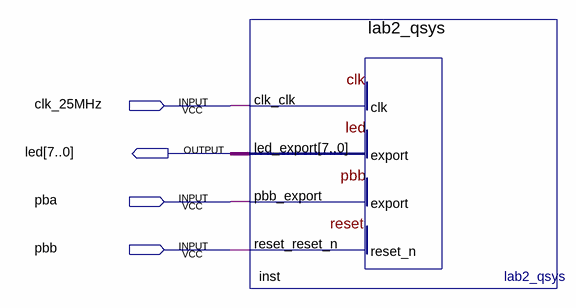
[diagram p0: schematic sheet]
// Quartus schematic lab2.bdf as structural Verilog: 1 symbols, 4 pins
module lab2 (
  input  clk_25MHz,
  input  pba,
  input  pbb,
  output [7:0] led
);

  lab2_qsys inst (.clk_clk(clk_25MHz), .pbb_export(pba), .reset_reset_n(pbb), .led_export(led));
endmodule
